# EAGLE design Processor Interface (EAGLE 6.3)
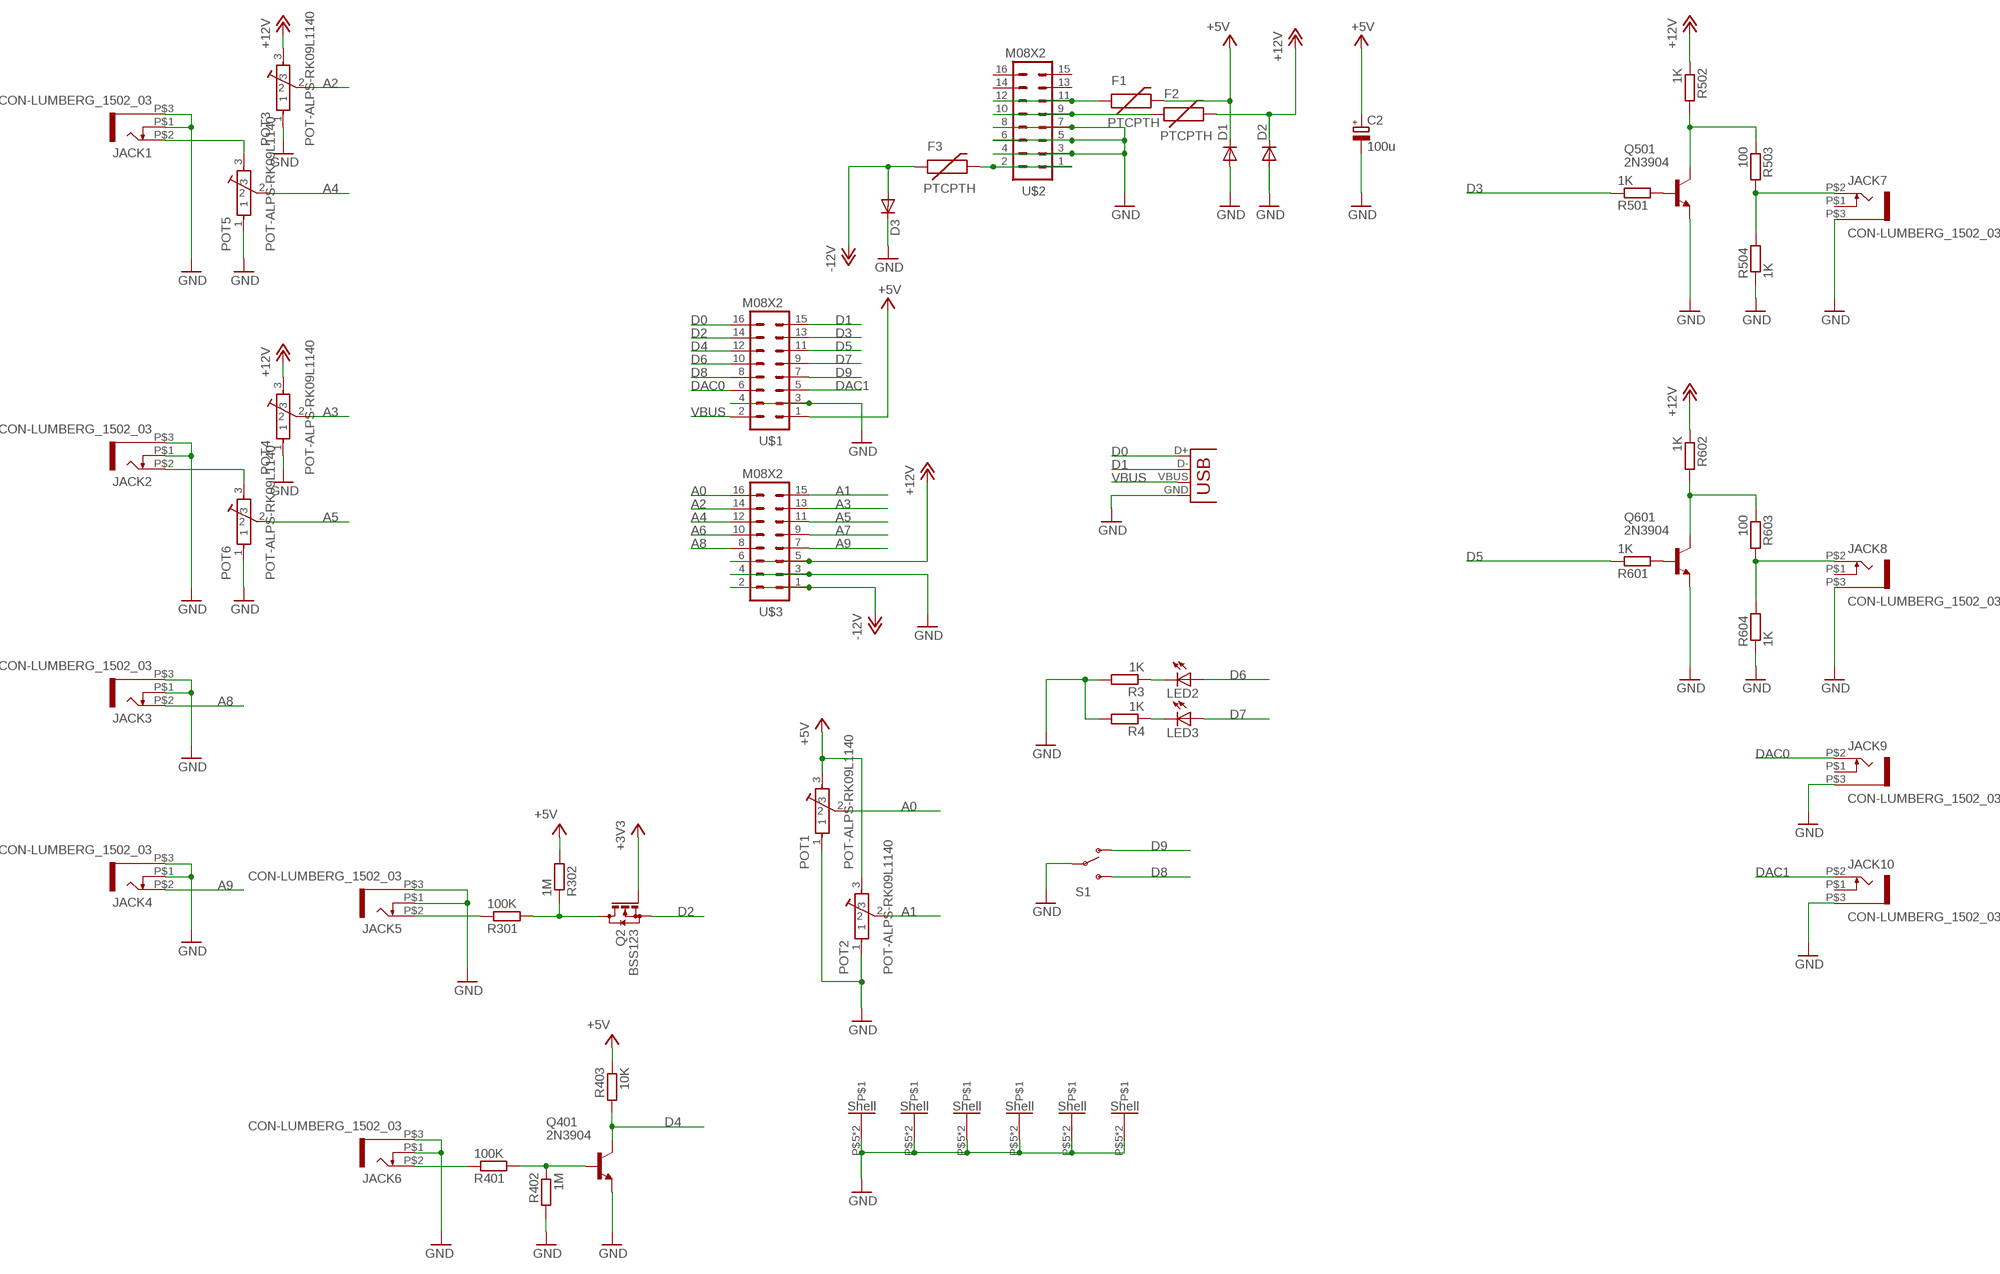
[diagram p0: schematic, sheet 1]

## Parts
C2  100u  CPOL-EUE5-6  [E5-6]
D1  DIODEPTH  [DIODE-1N4001]
D2  DIODEPTH  [DIODE-1N4001]
D3  DIODEPTH  [DIODE-1N4001]
F1  PTCPTH  [PTC]
F2  PTCPTH  [PTC]
F3  PTCPTH  [PTC]
JACK1  CON-LUMBERG_1502_03  [CON-LUMBERG_1502_03]
JACK2  CON-LUMBERG_1502_03  [CON-LUMBERG_1502_03]
JACK3  CON-LUMBERG_1502_03  [CON-LUMBERG_1502_03]
JACK4  CON-LUMBERG_1502_03  [CON-LUMBERG_1502_03]
JACK5  CON-LUMBERG_1502_03  [CON-LUMBERG_1502_03]
JACK6  CON-LUMBERG_1502_03  [CON-LUMBERG_1502_03]
JACK7  CON-LUMBERG_1502_03  [CON-LUMBERG_1502_03]
JACK8  CON-LUMBERG_1502_03  [CON-LUMBERG_1502_03]
JACK9  CON-LUMBERG_1502_03  [CON-LUMBERG_1502_03]
JACK10  CON-LUMBERG_1502_03  [CON-LUMBERG_1502_03]
LED2  LED3MM  [LED3MM]
LED3  LED3MM  [LED3MM]
POT1  POT-ALPS-RK09L1140  [POT-ALPS-RK09L1140]
POT2  POT-ALPS-RK09L1140  [POT-ALPS-RK09L1140]
POT3  POT-ALPS-RK09L1140  [POT-ALPS-RK09L1140]
POT4  POT-ALPS-RK09L1140  [POT-ALPS-RK09L1140]
POT5  POT-ALPS-RK09L1140  [POT-ALPS-RK09L1140]
POT6  POT-ALPS-RK09L1140  [POT-ALPS-RK09L1140]
Q2  BSS123  [SOT23]
Q401  2N3904  [TO92]
Q501  2N3904  [TO92]
Q601  2N3904  [TO92]
R3  1K  R-EU_0204/7  [0204/7]
R4  1K  R-EU_0204/7  [0204/7]
R301  100K  R-EU_0204/7  [0204/7]
R302  1M  R-EU_0204/7  [0204/7]
R401  100K  R-EU_0204/7  [0204/7]
R402  1M  R-EU_0204/7  [0204/7]
R403  10K  R-EU_0204/7  [0204/7]
R501  1K  R-EU_0204/7  [0204/7]
R502  1K  R-EU_0204/7  [0204/7]
R503  100  R-EU_0204/7  [0204/7]
R504  1K  R-EU_0204/7  [0204/7]
R601  1K  R-EU_0204/7  [0204/7]
R602  1K  R-EU_0204/7  [0204/7]
R603  100  R-EU_0204/7  [0204/7]
R604  1K  R-EU_0204/7  [0204/7]
S1  SWITCH-SPST  [SWITCH-SPDT-SALECOM-T8014]
U$1  M08X2  [2X8]
U$2  M08X2  [2X8]
U$3  M08X2  [2X8]
X1  USBPTH-VERTICAL  [USB-B-PTH-VERTICAL]

## Nets
+3V3: Q2.1(G)
+5V: C2.+ D1.C F1.P$2 POT1.3 POT2.3 R302.2 R403.1 U$1.1
+12V: D2.C F2.P$2 POT3.3 POT4.3 R502.1 R602.1 U$3.5 U$3.6
-12V: D3.A F3.P$1 U$3.1 U$3.2
A0: POT1.2 U$3.16
A1: POT2.2 U$3.15
A2: POT3.2 U$3.14
A3: POT4.2 U$3.13
A4: POT5.2 U$3.12
A5: POT6.2 U$3.11
A6: U$3.10
A7: U$3.9
A8: JACK3.P$2 U$3.8
A9: JACK4.P$2 U$3.7
D0: U$1.16 X1.D+
D1: U$1.15 X1.D-
D2: Q2.2(S) U$1.14
D3: R501.1 U$1.13
D4: Q401.1(C) R403.2 U$1.12
D5: R601.1 U$1.11
D6: LED2.A U$1.10
D7: LED3.A U$1.9
D8: S1.3(S) U$1.8
D9: S1.1(O) U$1.7
DAC0: JACK9.P$2 U$1.6
DAC1: JACK10.P$2 U$1.5
GND: C2.- D1.A D2.A D3.C JACK1.P$1 JACK1.P$3 JACK2.P$1 JACK2.P$3 JACK3.P$1 JACK3.P$3 JACK4.P$1 JACK4.P$3 JACK5.P$1 JACK5.P$3 JACK6.P$1 JACK6.P$3 JACK7.P$3 JACK8.P$3 JACK9.P$3 JACK10.P$3 POT1.1 POT1.P$5 POT1.P$6 POT2.1 POT2.P$5 POT2.P$6 POT3.1 POT3.P$5 POT3.P$6 POT4.1 POT4.P$5 POT4.P$6 POT5.1 POT5.P$5 POT5.P$6 POT6.1 POT6.P$5 POT6.P$6 Q401.3(E) Q501.3(E) Q601.3(E) R3.2 R4.2 R402.2 R504.1 R604.1 S1.2(P) U$1.3 U$1.4 U$2.3 U$2.4 U$2.5 U$2.6 U$2.7 U$2.8 U$3.3 U$3.4 X1.GND
N$1: JACK1.P$2 POT5.3
N$2: Q2.3(D) R301.2 R302.1
N$6: F3.P$2 U$2.1 U$2.2
N$12: JACK2.P$2 POT6.3
N$24: LED2.K(C) R3.1
N$25: LED3.K(C) R4.1
N$26: Q601.2(B) R601.2
N$28: JACK5.P$2 R301.1
N$30: JACK8.P$2 R603.2 R604.2
N$31: Q401.2(B) R401.2 R402.1
N$32: Q601.1(C) R602.2 R603.1
N$33: Q501.2(B) R501.2
N$36: JACK7.P$2 R503.2 R504.2
N$37: Q501.1(C) R502.2 R503.1
N$40: JACK6.P$2 R401.1
N$44: F1.P$1 U$2.11 U$2.12
N$45: F2.P$1 U$2.9 U$2.10
VBUS: U$1.2 X1.VBUS
Unconnected: JACK7.P$1 JACK8.P$1 JACK9.P$1 JACK10.P$1 U$2.13 U$2.14 U$2.15 U$2.16

## Library data of the parts
C2 = rcl:CPOL-EU: POLARIZED CAPACITOR, European symbol
D1-D3 = SparkFun:DIODE: Diode These are standard reverse protection diodes and small signal diodes. SMA package can handle up to about 1A. SOD-323 can handle about 200mA. What the SOD-323 package when ordering, there are some mfgs out there that are 5-pin packages.
F1-F3 = SparkFun:PTC: Resettable Fuse PTC Resettable Fuse. Spark Fun Electronics SKU : COM-08357
JACK1-JACK10 = Rebel:CON-LUMBERG_1502_03
LED2 LED3 = led:LED: LED OSRAM: - CHIPLED LG R971, LG N971, LY N971, LG Q971, LY Q971, LO R971, LY R971 LH N974, LH R974 LS Q976, LO Q976, LY Q976 LO Q996 - Hyper CHIPLED LW Q18S LB Q993, LB Q99A, LB R99A - SideLED LS A670, LO A670, LY A670, LG A670, LP A670 LB A673, LV A673, LT A673, LW A673 LH A674 LY A675 LS A676, LA A676, LO A676, LY A676, LW A676 LS A679, LY A679, LG A679 - Hyper Micro SIDELED® LS Y876, LA Y876, LO Y876, LY Y876 LT Y87S - SmartLED LW L88C, LW L88S LB L89C, LB L89S, LG L890 LS L89K, LO L89K, LY L89K LS L896, LA L896, LO L896, LY L896 - TOPLED LS T670, LO T670, LY T670, LG T670, LP T670 LSG T670, LSP T670, LSY T670, LOP T670, LYG T670 LG T671, LOG T671, LSG T671 LB T673, LV T673, LT T673, LW T673 LH T674 LS T676, LA T676, LO T676, LY T676, LB T676, LH T676, LSB T676, LW T676 LB T67C, LV T67C, LT T67C, LS T67K, LO T67K, LY T67K, LW E67C LS E67B, LA E67B, LO E67B, LY E67B, LB E67C, LV E67C, LT E67C LW T67C LS T679, LY T679, LG T679 LS T770, LO T770, LY T770, LG T770, LP T770 LB T773, LV T773, LT T773, LW T773 LH T774 LS E675, LA E675, LY E675, LS T675 LS T776, LA T776, LO T776, LY T776, LB T776 LHGB T686 LT T68C, LB T68C - Hyper Mini TOPLED® LB M676 - Mini TOPLED Santana® LG M470 LS M47K, LO M47K, LY M47K Source: http://www.osram.convergy.de LUXEON: - LUMILED® LXK2-PW12-R00, LXK2-PW12-S00, LXK2-PW14-U00, LXK2-PW14-V00 LXK2-PM12-R00, LXK2-PM12-S00, LXK2-PM14-U00 LXK2-PE12-Q00, LXK2-PE12-R00, LXK2-PE12-S00, LXK2-PE14-T00, LXK2-PE14-U00 LXK2-PB12-K00, LXK2-PB12-L00, LXK2-PB12-M00, LXK2-PB14-N00, LXK2-PB14-P00, LXK2-PB14-Q00 LXK2-PR12-L00, LXK2-PR12-M00, LXK2-PR14-Q00, LXK2-PR14-R00 LXK2-PD12-Q00, LXK2-PD12-R00, LXK2-PD12-S00 LXK2-PH12-R00, LXK2-PH12-S00 LXK2-PL12-P00, LXK2-PL12-Q00, LXK2-PL12-R00 Source: www.luxeon.com KINGBRIGHT: KA-3528ASYC Source: www.kingbright.com
POT1-POT6 = Rebel:POT-ALPS-RK09L
Q2 = transistor-small-signal:BSS123: N-CHANNEL MOS FET
Q401 Q501 Q601 = transistor-npn:2N3904: NPN Transistor
R3 R4 R301 R302 R401-R403 R501-R504 R601-R604 = rcl:R-EU_: RESISTOR, European symbol
S1 = Rebel:SWITCH-SPST: SPST Switch Simple slide switch. Spark Fun Electronics SKU : COM-00102
U$1-U$3 = SparkFun:M08X2
X1 = SparkFun:USB: USB Connectors USB-B-PTH is fully proven SKU : PRT-00139 USB-miniB is fully proven SKU : PRT-00587 USB-A-PCB is untested. USB-A-H is throughly reviewed, but untested. Spark Fun Electronics SKU : PRT-00437 USB-B-SMT is throughly reviewed, but untested. Needs silkscreen touching up. USB-A-S has not been used/tested USB-MB-H has not been used/tested

## Board
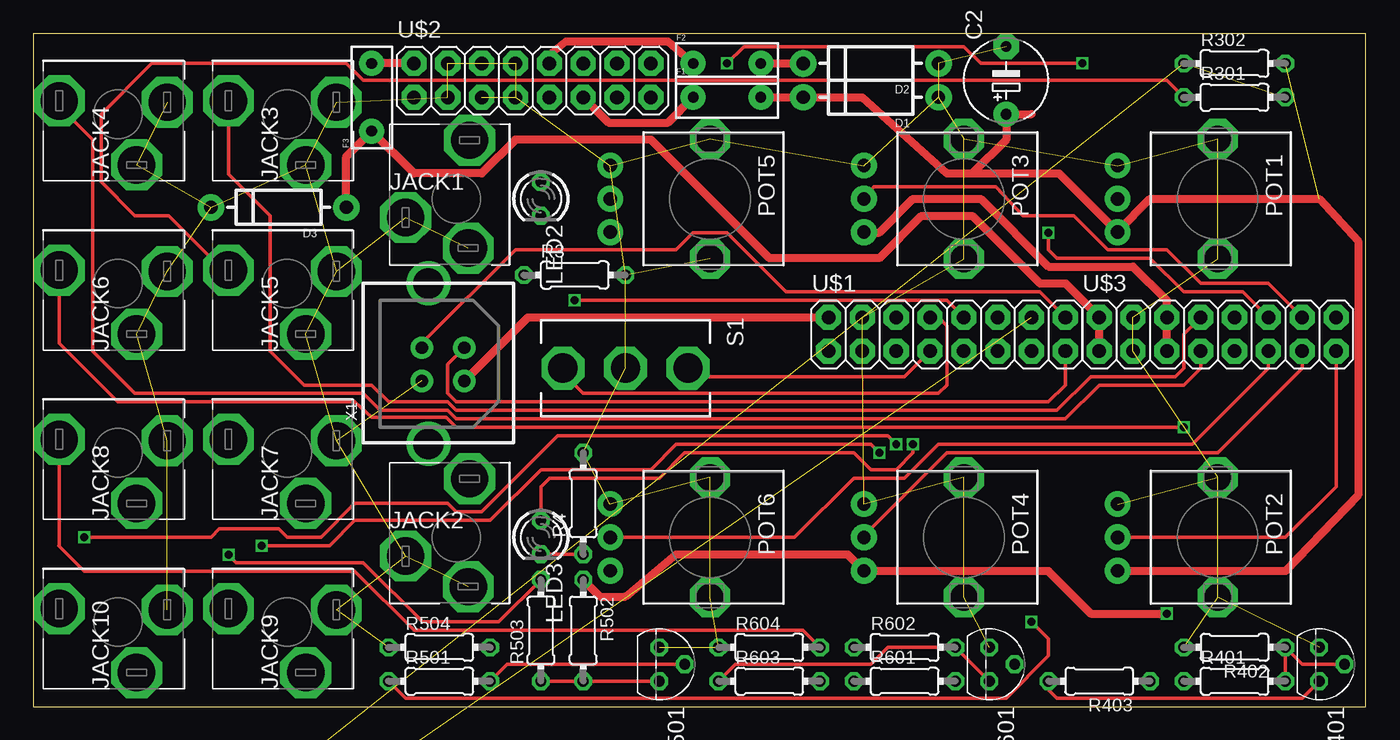
[diagram p1: board, top side]
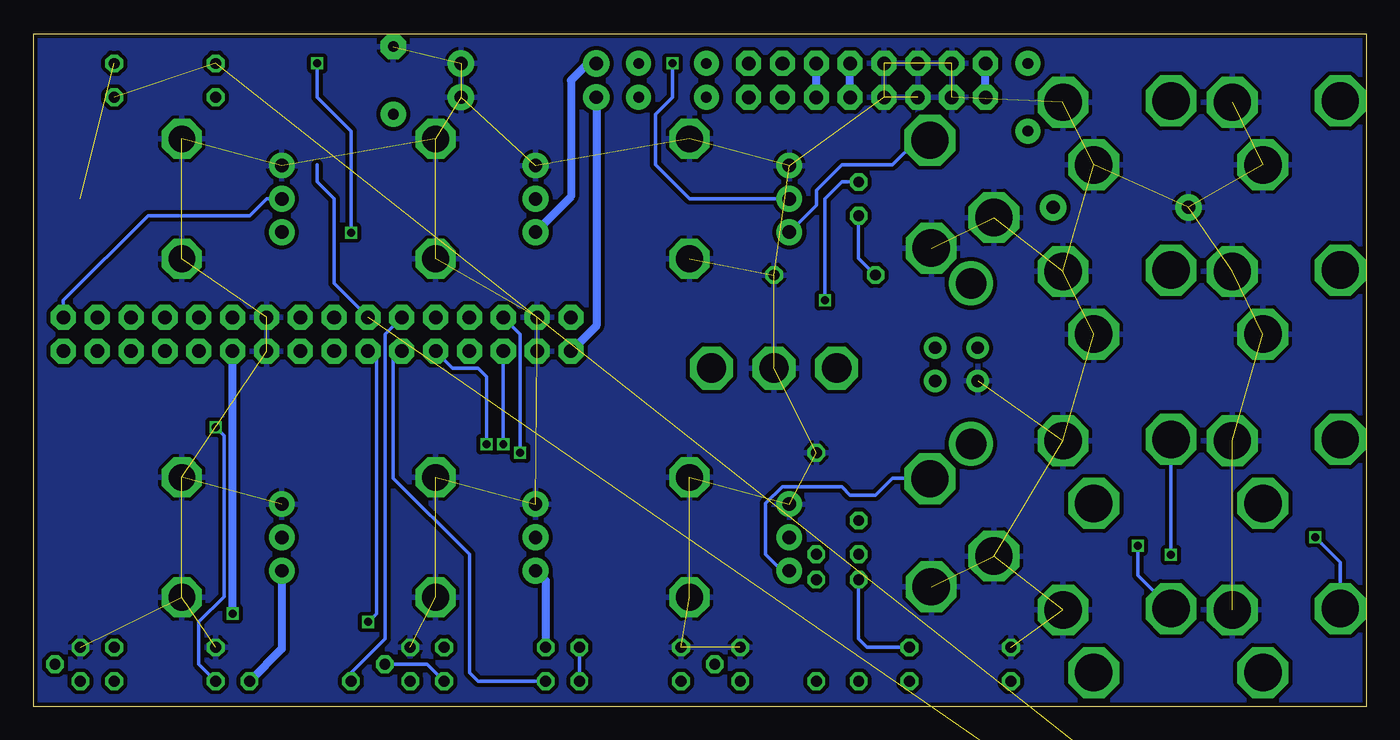
[diagram p2: board, bottom side, seen from below]

Size 100 x 50.5 mm. Coordinates in mm from the lower left corner, seen from the top.
Outline: 0,0 100,0 100,50.5 0,50.5 0,0
Copper layers (1*16): Top 0.035mm / dielectric 1.5mm / Bottom 0.035mm
Design rules "default": minimum track width 6mil, minimum drill 12mil, track to track 6mil, track to pad 6mil, pad to pad 6mil, via to via 6mil, smd to smd 0mil, copper to edge 10mil, drill to drill 10mil, minimum pad ring 10mil, minimum via ring 6mil, stop-mask expansion 2mil, vias tented up to drill 100mil, thermal gap 10mil

### Footprints (pad centres in the part's own frame; a part is rotated, then mirrored left to right if it is on the bottom)
E5-6 = drill 0.813 pad 1.905: + -2.54,0 | drill 0.813 pad 1.905 octagon: - 2.54,0
DIODE-1N4001 = drill 1 pad 1.981: A -5.08,0; C 5.08,0
PTC = drill 0.8 pad 1.88: P$1 -2.54,0; P$2 2.54,0
CON-LUMBERG_1502_03 = drill 2.8 octagon: P$1 -3.8,-1.4; P$2 1,4.4; P$3 0.9,-3.7
LED3MM = drill 0.813 octagon: A -1.27,0; K 1.27,0
POT-ALPS-RK09L1140 = drill 1 pad 1.93: 1 -2.5,-7.5; 2 0,-7.5; 3 2.5,-7.5 | drill 2 octagon: P$5 -4.5,0; P$6 4.5,0
SOT23 = smd 1 x 1.4: 1 -0.95,-1.1; 2 0.95,-1.1; 3 0,1.1
TO92 = drill 0.813 octagon: 1 1.27,0; 2 0,1.905; 3 -1.27,0
0204/7 = drill 0.813 octagon: 1 -3.81,0; 2 3.81,0
SWITCH-SPDT-SALECOM-T8014 = drill 2.2 octagon: 1 0,4.699; 2 0,0; 3 0,-4.699
2X8 = drill 1.016 pad 1.88 octagon: 1 0,0; 2 0,2.54; 3 2.54,0; 4 2.54,2.54; 5 5.08,0; 6 5.08,2.54; 7 7.62,0; 8 7.62,2.54; 9 10.16,0; 10 10.16,2.54; 11 12.7,0; 12 12.7,2.54; 13 15.24,0; 14 15.24,2.54; 15 17.78,0; 16 17.78,2.54
USB-B-PTH-VERTICAL = drill 0.914 pad 1.676: D+ 4.826,4.394; D- 4.826,7.595; GND 7.315,4.394; VBUS 7.315,7.595 | drill 2.286: P$1 0,4.902; P$2 12.04,4.902

### Placement (x,y rotation side)
C2  73.03,46.99 90 top
D1  62.87,45.72 180 top
D2  62.87,48.26 180 top
D3  18.41,37.47 180 top
F1  52.07,45.72 0 top
F2  52.07,48.26 0 top
F3  25.4,45.72 90 top
JACK1  31.75,38.1 0 top
JACK2  31.75,12.7 0 top
JACK3  19.05,44.45 90 top
JACK4  6.35,44.45 90 top
JACK5  19.05,31.75 90 top
JACK6  6.35,31.75 90 top
JACK7  19.05,19.05 90 top
JACK8  6.35,19.05 90 top
JACK9  19.05,6.35 90 top
JACK10  6.35,6.35 90 top
LED2  38.1,38.1 270 top
LED3  38.1,12.7 270 top
POT1  88.9,38.1 270 top
POT2  88.9,12.7 270 top
POT3  69.85,38.1 270 top
POT4  69.85,12.7 270 top
POT5  50.8,38.1 270 top
POT6  50.8,12.7 270 top
Q2  2.54,-19.05 0 top  (outside the outline)
Q401  96.52,3.17 270 top
Q501  46.99,3.17 270 top
Q601  71.75,3.17 270 top
R3  40.64,32.38 0 top
R4  41.27,15.24 90 top
R301  90.17,45.72 0 top
R302  90.17,48.26 0 top
R401  90.17,1.91 0 top
R402  90.17,4.45 180 top
R403  80.01,1.91 180 top
R501  30.48,1.91 0 top
R502  41.27,5.71 270 top
R503  38.1,5.71 90 top
R504  30.48,4.45 0 top
R601  65.41,1.91 0 top
R602  65.41,4.45 0 top
R603  55.24,1.91 0 top
R604  55.24,4.45 0 top
S1  44.45,25.4 270 top
U$1  59.69,26.67 0 top
U$2  28.57,45.72 0 top
U$3  80.01,26.67 0 top
X1  24.77,31.75 270 top

### Tracks (layer width: path | path; a pad name or v marks a point on that pad's centre or on a via)
+5V  (1 unrouted)
  Top 0.61: F1.P$2 D1.C 62.23,45.72 68.58,40.01 70.48,40.01 | 70.48,40.01 77,40.01 POT1.3 81.4,35.68 83.82,38.1 96.52,38.1 99.44,34.92 99.44,15.88 93.98,10.16 81.44,10.16 POT2.3 | 74.93,44.45 C2.+ 73.03,42.55 70.48,40.01
  Bottom 0.61: POT2.3 81.4,4.33 R403.1 | D1.C 57.78,28.57 U$1.1
+12V  (via drill 0.6)
  Top 0.61: F2.P$2 D2.C | U$3.5 U$3.6 85.09,30.48 82.55,33.02 76.2,33.02 71.12,38.1 66.04,38.1 63.5,35.56 62.31,35.56 POT3.3 | v85.09,6.99 79.38,6.99 76.2,10.16 62.39,10.16 POT4.3 61.12,11.43 48.26,11.43 44.45,8.26 42.55,8.26 R502.1
  Bottom 0.61: D2.C 58.42,48.26 59.69,46.99 59.69,38.26 POT3.3 | R602.1 61.59,9.45 POT4.3 | v85.09,6.99 U$3.5
-12V
  Top 0.61: D3.A 23.5,41.27 F3.P$1 28.57,40.01 33.66,40.01 36.2,42.55 46.35,42.55 55.24,33.66 63.5,33.66 66.67,36.83 70.48,36.83 75.56,31.75 77.47,31.75 U$3.2 U$3.1
A0
  Bottom 0.254: U$3.16 97.79,30.48 91.44,36.83 83.82,36.83 82.55,38.1 POT1.2
A1
  Top 0.254: POT2.2 93.98,12.7 97.79,16.51 U$3.15
A2
  Top 0.254: POT3.2 63.12,38.99 72.26,38.99 74.3,36.83 78.11,36.83 80.64,34.29 85.09,34.29 87.63,31.75 92.71,31.75 U$3.14
A3
  Top 0.254: POT4.2 62.23,12.7 68.58,19.05 88.9,19.05 95.25,25.4 U$3.13
A4  (via drill 0.6)
  Top 0.254: v78.74,48.26 71.12,48.26 69.85,49.53 53.34,49.53 v52.07,48.26 | v76.2,35.56 76.2,34.29 76.83,33.66 83.82,33.66 86.36,31.11 90.81,31.11 U$3.12
  Bottom 0.254: v52.07,48.26 52.07,45.72 53.34,44.45 53.34,40.64 50.8,38.1 POT5.2 43.18,38.1 | v76.2,35.56 76.2,43.18 78.74,45.72 v78.74,48.26
A5
  Top 0.254: POT6.2 57.15,12.7 61.59,17.14 65.41,17.14 67.94,19.68 87,19.68 92.71,25.4 U$3.11
A8
  Top 0.254: JACK3.P$2 14.65,39.96 17.78,36.83 17.78,26.67 20.32,24.13 25.4,24.13 26.67,22.86 31.11,22.86 31.75,22.23 76.83,22.23 79.38,24.77 85.72,24.77 86.36,25.4 86.36,27.94 U$3.8
A9
  Top 0.254: JACK4.P$2 1.95,45.04 4.45,42.55 4.45,26.67 7.62,23.5 24.77,23.5 26.04,22.23 31.11,22.23 31.75,21.59 77.47,21.59 80.01,24.13 86.36,24.13 87.63,25.4 U$3.7
D0
  Top 0.254: X1.D+ 29.16,27.25 36.2,34.29 48.26,34.29 49.53,35.56 52.07,35.56 56.52,31.11 75.56,31.11 U$1.16
D1
  Top 0.254: U$1.15 77.47,24.13 76.2,22.86 31.75,22.86 31.11,23.5 31.11,25.68 X1.D-
D2  (1 unrouted)
  Bottom 0.254: U$1.14 77.47,31.75 77.47,38.1 78.74,39.37 78.74,40.64
D3  (via drill 0.6)
  Top 0.254: R501.1 27.94,0.64 73.03,0.64 76.2,3.81 76.2,5.08 v74.93,6.35
  Bottom 0.254: v74.93,6.35 74.3,6.99 74.3,26.04 U$1.13
D4
  Top 0.254: R403.2 76.2,1.27 76.83,0.64 95.25,0.64 Q401.1
  Bottom 0.254: U$1.12 73.66,27.94 73.66,5.08 76.2,2.54 R403.2
D5
  Bottom 0.254: R601.1 66.67,1.91 67.31,2.54 67.31,11.43 73.03,17.14 73.03,26.04 U$1.11
D6  (via drill 0.6)
  Top 0.254: v40.64,30.48 68.58,30.48 U$1.10
  Bottom 0.254: LED2.A 39.37,39.37 40.64,38.1 v40.64,30.48
D7  (via drill 0.6)
  Top 0.254: LED3.A 38.1,16.51 38.73,17.14 46.99,17.14 48.9,19.05 61.59,19.05 62.87,17.78 64.77,17.78 66.04,19.05 v66.04,19.68
  Bottom 0.254: U$1.9 68.58,25.4 66.67,25.4 66.04,24.77 v66.04,19.68
D8
  Top 0.254: U$1.8 67.94,29.21 68.58,28.57 68.58,24.13 67.94,23.5 41.27,23.5 39.75,25.02 S1.3
D9
  Top 0.254: U$1.7 65.41,24.77 49.78,24.77 S1.1
DAC0  (via drill 0.6)
  Top 0.254: v17.14,12.06 22.23,12.06 24.13,13.97 34.29,13.97 38.1,17.78 46.35,17.78 48.26,19.68 62.87,19.68 v63.5,19.05
  Bottom 0.254: v63.5,19.05 63.5,27.94 U$1.6 | v17.14,12.06 17.14,9.85 JACK9.P$2
DAC1  (via drill 0.6)
  Top 0.254: v64.77,19.68 64.14,20.32 39.37,20.32 33.66,14.61 31.75,14.61 31.11,15.24 24.13,15.24 21.59,12.7 19.05,12.7 18.41,13.34 13.97,13.34 13.34,12.7 v3.81,12.7
  Bottom 0.254: v64.77,19.68 U$1.5 | JACK10.P$2 1.95,10.84 v3.81,12.7
GND  (57 unrouted)
  pour Bottom (isolate 0.305): 0,0 0,50.8 100.33,50.8 100.33,0
N$1
  Bottom 0.254: POT5.3 41.27,37.62 41.27,38.73 39.37,40.64 35.56,40.64 33.7,42.5 JACK1.P$2
N$2  (2 unrouted)
N$6
  Top 0.61: U$2.2 F3.P$2
  Bottom 0.61: U$2.1 U$2.2
N$12
  Bottom 0.254: POT6.3 43.34,10.16 43.81,10.16 45.09,11.43 45.09,15.24 43.81,16.51 39.37,16.51 38.73,15.88 36.83,15.88 35.56,17.14 32.8,17.14 JACK2.P$2
N$24
  Bottom 0.254: LED2.K 38.1,33.66 R3.1
N$25
  Top 0.254: LED3.K R4.1
N$26
  Bottom 0.254: Q601.2 70.48,3.17 R601.2
N$28
  Top 0.254: R301.1 85.09,46.99 24.77,46.99 23.5,48.26 8.89,48.26 5.08,44.45 5.08,39.37 7.62,36.83 10.16,36.83 14.24,32.75 JACK5.P$2
N$30
  Top 0.254: R604.2 57.78,5.71 28.57,5.71 24.13,10.16 3.81,10.16 1.91,12.06 1.95,12.11 JACK8.P$2
  Bottom 0.254: R603.2 R604.2
N$31
  Top 0.254: Q401.2 95.25,3.17 R402.1 R401.2
N$32
  Top 0.254: Q601.1 R602.2 64.14,4.45 62.87,3.17 52.7,3.17 R603.1
N$33
  Top 0.254: R501.2 35.56,3.17 Q501.2
N$36  (via drill 0.6)
  Top 0.254: v14.65,11.38 15.24,10.79 24.77,10.79 29.21,6.35 34.92,6.35 R503.2
  Bottom 0.254: R504.2 37.47,4.45 38.1,5.08 R503.2 | JACK7.P$2 v14.65,11.38
N$37
  Top 0.254: R503.1 R502.2 Q501.1
N$40  (via drill 0.6)
  Top 0.254: JACK6.P$2 1.95,27.26 6.35,22.86 24.13,22.86 25.4,21.72 30.99,21.72 31.75,20.95 v86.36,20.95
  Bottom 0.254: R401.1 87.63,3.17 87.63,6.35 85.72,8.26 85.72,20.32 v86.36,20.95
N$44
  Top 0.61: U$2.11 43.18,43.81 47.62,43.81 F1.P$1
  Bottom 0.61: U$2.11 U$2.12
N$45
  Top 0.61: U$2.10 38.73,48.9 40.01,49.91 47.62,49.91 F2.P$1
  Bottom 0.61: U$2.9 U$2.10
VBUS
  Top 0.61: X1.VBUS 37.13,29.21 U$1.2